# Altium schematic sheet MainSheetDemo.SchDoc
size A4; SheetNumber: 1; SheetTotal: 1
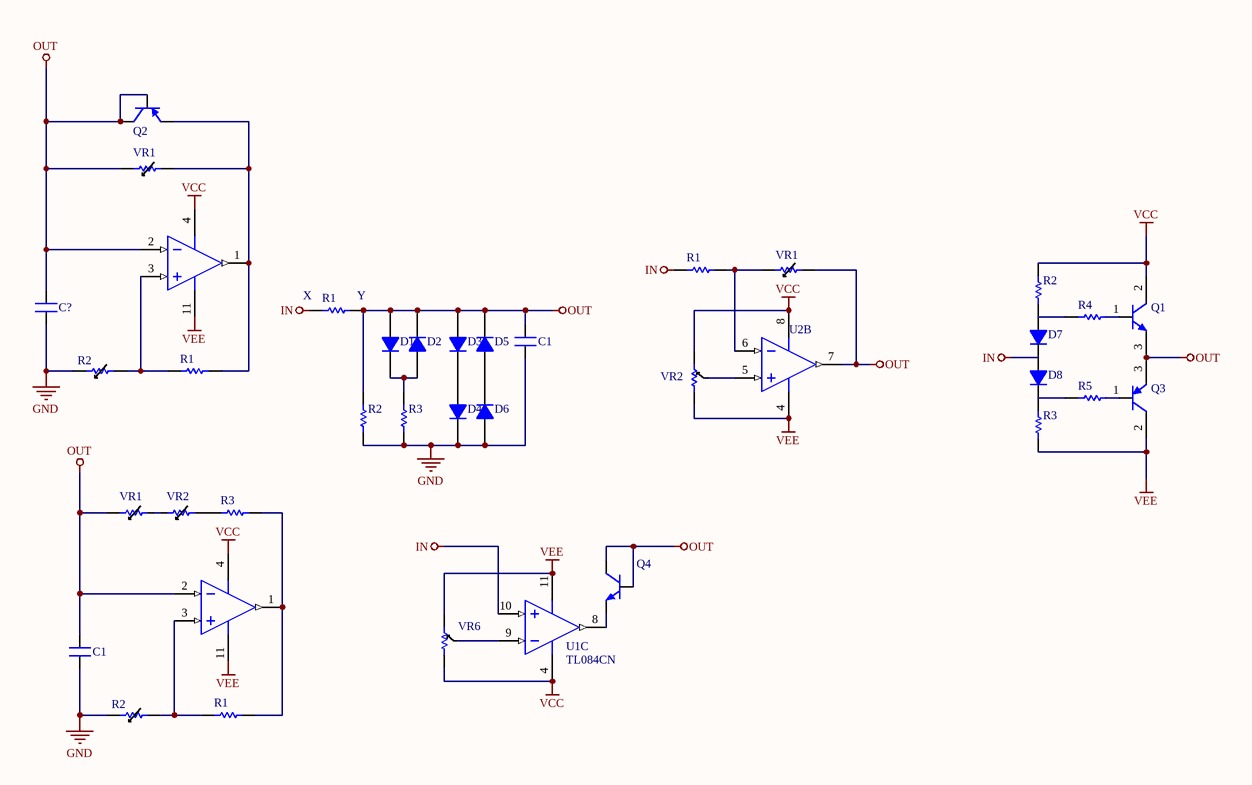
[diagram p0: MainSheetDemo.SchDoc]

## Parts
(Parts that share a designator on the sheet are numbered #1, #2 ... from top to bottom, then left to right.)
C1#1  Cap3  [CAP3]  (value not drawn)
C1#2  Cap3  [CAP4(200mil)]  (value not drawn)
C?  Cap3  [CAP4(200mil)]  (value not drawn)
D1  1N4007  [1N4007]  (value not drawn)
D2  1N4007  [1N4007]  (value not drawn)
D3  1N4007  [1N4007]  (value not drawn)
D4  1N4007  [1N4007]  (value not drawn)
D5  1N4007  [1N4007]  (value not drawn)
D6  1N4007  [1N4007]  (value not drawn)
D7  1N4007  [1N4007]  (value not drawn)
D8  1N4007  [1N4007]  (value not drawn)
Q1  TIP31  [ONSC-TO-220-3-221A-09]  (value not drawn)
Q2  B562  [TO-92_ONS]  (value not drawn)
Q3  TIP32  [ONSC-TO-220-3-221A-09]  (value not drawn)
Q4  D400  [TO-92_ONS]  (value not drawn)
R1#1  Res1  [RES]  (value not drawn)
R1#2  Res1  [RES]  (value not drawn)
R1#3  Res1  [RES]  (value not drawn)
R1#4  Res1  [RES]  (value not drawn)
R2#1  Res1  [RES]  (value not drawn)
R2#2  VR2_2PIN  [VR_VOL_CTRL_2]  (value not drawn)
R2#3  Res1  [RES]  (value not drawn)
R2#4  VR2_2PIN  [VR_VOL_CTRL_2]  (value not drawn)
R3#1  Res1  [RES]  (value not drawn)
R3#2  Res1  [RES]  (value not drawn)
R3#3  Res1  [RES]  (value not drawn)
R4  Res1  [RES]  (value not drawn)
R5  Res1  [RES]  (value not drawn)
U1  TL084CN  [N0014A]  (value not drawn)  (parts A,C of 4)
U2  LF412CN  [N08E]  (value not drawn)  (part B of 2)
U?  TL084CN  [N0014A]  (value not drawn)  (part A of 4)
VR1#1  VR2_2PIN  [VR_VOL_CTRL_2]  (value not drawn)
VR1#2  VR2_2PIN  [VR_VOL_CTRL_2]  (value not drawn)
VR1#3  VR2_2PIN  [VR_VOL_CTRL_2]  (value not drawn)
VR2#1  VR7  [VR_VOL_CTRL]  (value not drawn)
VR2#2  VR2_2PIN  [VR_VOL_CTRL_2]  (value not drawn)
VR6  VR3  [VR_VOL_CTRL]  (value not drawn)

## Nets
GND: C1#1.1 C1#2.1 C?.1 D4.2(K) D6.1(A) R2#2.1 R2#3.1 R2#4.1 R3#1.1
IN: R1#1.2 R1#2.2 U1.10(IN3+)
OUT: C1#1.2 C1#2.2 C?.2 D1.1(A) D2.2(K) D3.1(A) D5.2(K) Q1.3(E) Q2.2(C) Q2.3(B) Q3.3(E) Q4.2(C) Q4.3(B) R1#2.1 R2#3.2 U1.2(IN1-) U2.7(OUTB) U?.2(IN1-) VR1#1.1 VR1#2.2 VR1#3.1
VCC: Q1.2(C) R2#1.2 U1.4(VCC+) U2.8(V+) U?.4(VCC+) VR2#1.2 VR6.3
VEE: Q3.2(C) R3#2.1 U1.11(VCC-) U2.4(V-) U?.11(VCC-) VR2#1.3 VR6.2
NetD1_2: D1.2(K) D2.1(A) R3#1.2
NetD3_2: D3.2(K) D4.1(A)
NetD5_1: D5.1(A) D6.2(K)
NetQ1_1: Q1.1(B) R4.1
NetQ2_1: Q2.1(E) R1#3.2 U?.1(OUT1) VR1#1.2
NetQ3_1: Q3.1(B) R5.1
NetQ4_1: Q4.1(E) U1.8(OUT3)
NetR1#1_1: R1#1.1 U2.6(INB-) VR1#2.1
NetR1#3_1: R1#3.1 R2#2.2 U?.3(IN1+)
NetR1#4_1: R1#4.1 R2#4.2 U1.3(IN1+)
NetR1#4_2: R1#4.2 R3#3.2 U1.1(OUT1)
NetR2#1_1: R2#1.1 R4.2
NetR3#2_2: R3#2.2 R5.2
NetR3#3_1: R3#3.1 VR2#2.2
NetU1_9: U1.9(IN3-) VR6.1
NetU2_5: U2.5(INB+) VR2#1.1
NetVR1#3_2: VR1#3.2 VR2#2.1

Not connected (* = marked no-connect by the designer): D7 1(A) 2(K); D8 1(A) 2(K)

## Notes on the sheet
- (near R1#2) X
- (near R1#2) Y

## Library data of the parts
C1#1 C1#2 C? = Cap3: Capacitor; Published: 23-Sep-2002; PackageReference: CAPR5-4X5; Publisher: Altium Limited; PackageDescription: Capacitor; 2 Leads; Value: *
D1-D8 = 1N4007: 1 Amp General Purpose Rectifier; Published: 8-Jun-2000; LatestRevisionDate: 17-Jul-2002; LatestRevisionNote: Re-released for DXP Platform.; DatasheetVersion: 1998; PackageVersion: Aug-1999; PackageReference: DO-41; Publisher: Altium Limited; PackageDescription: Diode, Axial; Body 5.2 x 2.7 mm (LxDia. max), Lead Dia. 0.86 mm (max); Code_JEDEC: DO-204-AL; ComponentLink1Description: Manufacturer Link; ComponentLink1URL: http://www.fairchildsemi.com/; ComponentLink2Description: Datasheet; ComponentLink2URL: http://www.fairchildsemi.com/ds/1N%2F1N4001.pdf
Q1 = CMP-1048-01139-1: Complementary Silicon Plastic Power Transistor, 3-Pin TO-220, Tube; Manufacturer: On Semiconductor; IC Continuous (A): 3; Polarity: NPN; ComponentLink3URL: http://www.onsemi.com/pub_link/Collateral/221A-09.PDF; DatasheetVersion: Rev. 14; ComponentLink3Description: Package Specification; Packing: Tube; Mounting Technology: Through Hole; RoHS: FALSE; ComponentLink1Description: Manufacturer URL; PartNumber: TIP31; PackageDescription: 3-Pin Flange Mount, Vertical Straight Lead, Body 9.97 x 4.445 mm, Pitch 2.54 mm; fT Min (MHz): 3; PackageReference: TO-220-3-221A-09; PackageVersion: Rev. AG, 09/2011; ComponentLink2URL: http://www.onsemi.com/pub_link/Collateral/TIP31A-D.PDF; ComponentLink1URL: http://www.onsemi.com/; ComponentLink2Description: Datasheet
Q2 = A733: PNP General Purpose Transistor; Published: 8-Jun-2000; LatestRevisionDate: 15-Jan-2003; LatestRevisionNote: PCB Footprint 'BCY-W3/D4.7' replaced; DatasheetVersion: 1997; PackageVersion: Sep-1998; PackageReference: TO-92A; Publisher: Altium Limited; PackageDescription: TO, Flat Index; 3 In-Line, Axial Leads; Body Dia. 4.5mm; Leads 0.51 x 0.48 mm (max); ComponentLink1Description: Manufacturer Link; ComponentLink1URL: http://www.fairchildsemi.com/; ComponentLink2Description: Datasheet; ComponentLink2URL: http://www.fairchildsemi.com/ds/2N%2F2N3906.pdf
Q3 = CMP-1048-01071-1: Complementary Silicon Plastic Power Transistor, 3-Pin TO-220, Tube; Manufacturer: On Semiconductor; Polarity: PNP; IC Continuous (A): 3; ComponentLink1URL: http://www.onsemi.com/; RoHS: FALSE; ComponentLink3URL: http://www.onsemi.com/pub_link/Collateral/221A-09.PDF; PartNumber: TIP32; Mounting Technology: Through Hole; PackageDescription: 3-Pin Flange Mount, Vertical Straight Lead, Body 9.97 x 4.445 mm, Pitch 2.54 mm; ComponentLink2Description: Datasheet; ComponentLink3Description: Package Specification; ComponentLink1Description: Manufacturer URL; PackageVersion: Rev. AG, 09/2011; ComponentLink2URL: http://www.onsemi.com/pub_link/Collateral/TIP31A-D.PDF; Packing: Tube; DatasheetVersion: Rev. 14; fT Min (MHz): 3; PackageReference: TO-220-3-221A-09
Q4 = C828: NPN General Purpose Transistor; Published: 8-Jun-2000; LatestRevisionDate: 15-Jan-2003; LatestRevisionNote: PCB Footprint 'BCY-W3/D4.7' replaced; DatasheetVersion: 1997; PackageVersion: Sep-1998; PackageReference: TO-92A; Publisher: Altium Limited; PackageDescription: TO, Flat Index; 3 In-Line, Axial Leads; Body Dia. 4.5mm; Leads 0.51 x 0.48 mm (max); ComponentLink1Description: Manufacturer Link; ComponentLink1URL: http://www.fairchildsemi.com/; ComponentLink2Description: Datasheet; ComponentLink2URL: http://www.fairchildsemi.com/ds/2N%2F2N3904.pdf
R1#1-R1#4 R2#1 R2#3 R3#1-R3#3 R4 R5 = Res1: Resistor; Published: 8-Jun-2000; LatestRevisionDate: 17-Jul-2002; LatestRevisionNote: Re-released for DXP Platform.; PackageReference: AXIAL-0.3; Publisher: Altium Limited; PackageDescription: Axial Device, Thru-Hole; 2 Leads; 0.3 in Pin Spacing; Value: *
U1 U? = CMP-0017-00818-2: JFET-Input Operational Amplifier, 7 to 36 V, 0 to 70 degC, 14-pin DIP (N14), Pb-Free (RoHS); Manufacturer: Texas Instruments; Rating: Catalog; Iq per channel(Max)(mA): 2.8; Number of Channels: 4; IIB(Max)(pA): 400; Vio (25C)(Max)(mV): 15; GBW(Typ)(MHz): 3; Total Supply Voltage(Max)(+5V is 5, +/-5V is 10): 36; Vn at 1kHz(Typ)(nV/rtHz): 18; Sub Family: General Purpose Amplifier, High Supply Voltage Amplifier (>=30V); Slew Rate(Typ)(V/us): 13; Total Supply Voltage(Min)(+5V is 5, +/-5V is 10): 7; CMRR(Min)(dB): 70; ComponentLink3Description: Package Specification; PackageDescription: 14-Pin Plastic In-Line, Body 19.305 x 6.35 mm, Pitch 2.54 mm; ComponentLink1Description: Manufacturer URL; PackageVersion: 4040049/E, 12/2002; Eco-Plan: Pb-Free (RoHS); ComponentLink2URL: http://www.ti.com/lit/ds/symlink/tl084.pdf; ComponentLink1URL: http://www.ti.com/; DatasheetVersion: SLOS081G; Mounting Technology: Through Hole; PartNumber: TL084CN; Offset Drift(Typ)(uV/C): 18; PackageReference: N0014A; ComponentLink3URL: http://www.ti.com/lit/ml/mpdi002c/mpdi002c.pdf; ComponentLink2Description: Datasheet; Code_JEDEC: MS-001
U2 = CMP-0055-00193-2: Low Offset, Low Drift Dual JFET Input Operational Amplifier, 8-pin MDIP; Manufacturer: National Semiconductor; PowerWise: N; CompType: Amplifiers; PackageTopMarking: NSUZXYTTE#*LF*412CN; ComponentLink1Description: LF412 Datasheet; RevisionNote: Component URLs added; PackageReference: N08E; ComponentLink3URL: http://www.national.com/packaging/folders/n08e.html; ComponentLink2URL: http://www.national.com/pf/LF/LF412.html; RoHS: N; DatasheetVersion: Jan-2010; ComponentLink2Description: LF412 Web Page; PackageDescription: MDIP, .365 x .250 x .130in, 8 Lead, .100in Pitch; PinCount: 8; ComponentLink1URL: http://www.national.com/ds/LF/LF412.pdf; PackageVersion: revG, May-2006; ComponentLink3Description: N08E Package Page; Code_JEDEC: MS-001-BA
VR2#1 = VR3: Value: 100k
R2#2 R2#4 VR1#1-VR1#3 VR2#2 = VR2_2PIN: Value: *
VR6 = VR3: Value: *